# Altium project Ortho4Exent.PrjPcb
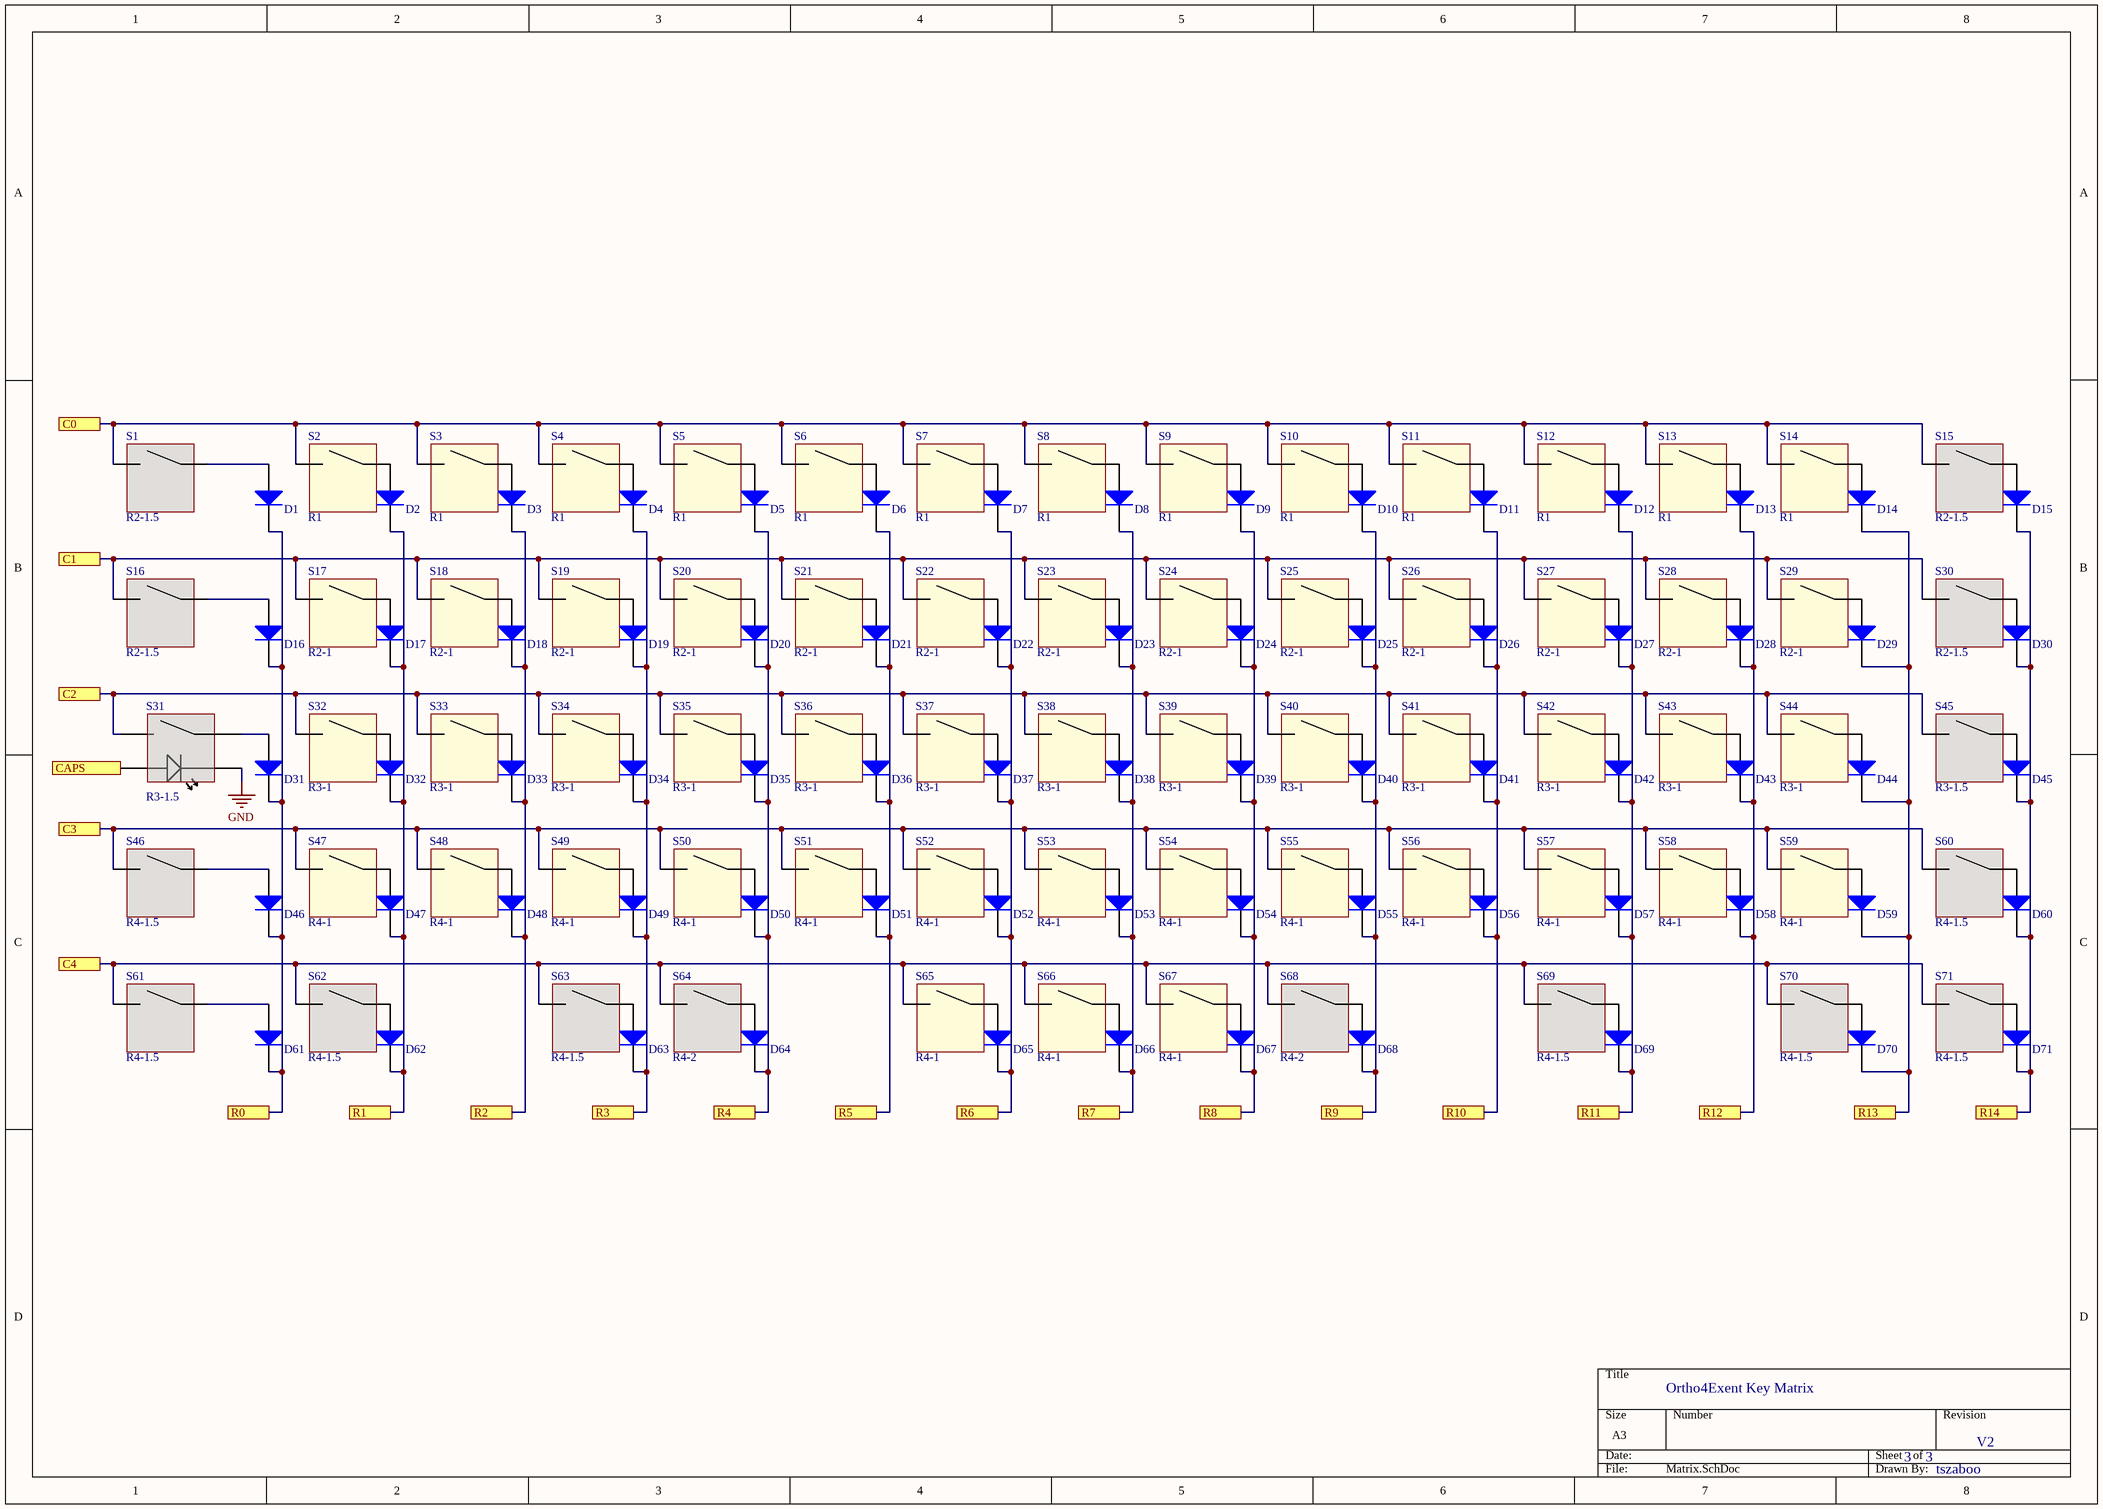
[diagram p0: Matrix.SchDoc]
3 sheets, 199 parts. Net scope: flat (ports and power ports of the same name join across sheets).
Board file: pcb.PcbDoc
Sheets:
  Matrix.SchDoc
  Underglow.SchDoc
  MCU.SchDoc

## Sheet Matrix.SchDoc
size A3; DocumentNumber: 3; SheetNumber: 3; SheetTotal: 3

### Parts
D1  1N4148WS  [SOD323FL]  (value not drawn)
D2  1N4148WS  [SOD323FL]  (value not drawn)
D3  1N4148WS  [SOD323FL]  (value not drawn)
D4  1N4148WS  [SOD323FL]  (value not drawn)
D5  1N4148WS  [SOD323FL]  (value not drawn)
D6  1N4148WS  [SOD323FL]  (value not drawn)
D7  1N4148WS  [SOD323FL]  (value not drawn)
D8  1N4148WS  [SOD323FL]  (value not drawn)
D9  1N4148WS  [SOD323FL]  (value not drawn)
D10  1N4148WS  [SOD323FL]  (value not drawn)
D11  1N4148WS  [SOD323FL]  (value not drawn)
D12  1N4148WS  [SOD323FL]  (value not drawn)
D13  1N4148WS  [SOD323FL]  (value not drawn)
D14  1N4148WS  [SOD323FL]  (value not drawn)
D15  1N4148WS  [SOD323FL]  (value not drawn)
D16  1N4148WS  [SOD323FL]  (value not drawn)
D17  1N4148WS  [SOD323FL]  (value not drawn)
D18  1N4148WS  [SOD323FL]  (value not drawn)
D19  1N4148WS  [SOD323FL]  (value not drawn)
D20  1N4148WS  [SOD323FL]  (value not drawn)
D21  1N4148WS  [SOD323FL]  (value not drawn)
D22  1N4148WS  [SOD323FL]  (value not drawn)
D23  1N4148WS  [SOD323FL]  (value not drawn)
D24  1N4148WS  [SOD323FL]  (value not drawn)
D25  1N4148WS  [SOD323FL]  (value not drawn)
D26  1N4148WS  [SOD323FL]  (value not drawn)
D27  1N4148WS  [SOD323FL]  (value not drawn)
D28  1N4148WS  [SOD323FL]  (value not drawn)
D29  1N4148WS  [SOD323FL]  (value not drawn)
D30  1N4148WS  [SOD323FL]  (value not drawn)
D31  1N4148WS  [SOD323FL]  (value not drawn)
D32  1N4148WS  [SOD323FL]  (value not drawn)
D33  1N4148WS  [SOD323FL]  (value not drawn)
D34  1N4148WS  [SOD323FL]  (value not drawn)
D35  1N4148WS  [SOD323FL]  (value not drawn)
D36  1N4148WS  [SOD323FL]  (value not drawn)
D37  1N4148WS  [SOD323FL]  (value not drawn)
D38  1N4148WS  [SOD323FL]  (value not drawn)
D39  1N4148WS  [SOD323FL]  (value not drawn)
D40  1N4148WS  [SOD323FL]  (value not drawn)
D41  1N4148WS  [SOD323FL]  (value not drawn)
D42  1N4148WS  [SOD323FL]  (value not drawn)
D43  1N4148WS  [SOD323FL]  (value not drawn)
D44  1N4148WS  [SOD323FL]  (value not drawn)
D45  1N4148WS  [SOD323FL]  (value not drawn)
D46  1N4148WS  [SOD323FL]  (value not drawn)
D47  1N4148WS  [SOD323FL]  (value not drawn)
D48  1N4148WS  [SOD323FL]  (value not drawn)
D49  1N4148WS  [SOD323FL]  (value not drawn)
D50  1N4148WS  [SOD323FL]  (value not drawn)
D51  1N4148WS  [SOD323FL]  (value not drawn)
D52  1N4148WS  [SOD323FL]  (value not drawn)
D53  1N4148WS  [SOD323FL]  (value not drawn)
D54  1N4148WS  [SOD323FL]  (value not drawn)
D55  1N4148WS  [SOD323FL]  (value not drawn)
D56  1N4148WS  [SOD323FL]  (value not drawn)
D57  1N4148WS  [SOD323FL]  (value not drawn)
D58  1N4148WS  [SOD323FL]  (value not drawn)
D59  1N4148WS  [SOD323FL]  (value not drawn)
D60  1N4148WS  [SOD323FL]  (value not drawn)
D61  1N4148WS  [SOD323FL]  (value not drawn)
D62  1N4148WS  [SOD323FL]  (value not drawn)
D63  1N4148WS  [SOD323FL]  (value not drawn)
D64  1N4148WS  [SOD323FL]  (value not drawn)
D65  1N4148WS  [SOD323FL]  (value not drawn)
D66  1N4148WS  [SOD323FL]  (value not drawn)
D67  1N4148WS  [SOD323FL]  (value not drawn)
D68  1N4148WS  [SOD323FL]  (value not drawn)
D69  1N4148WS  [SOD323FL]  (value not drawn)
D70  1N4148WS  [SOD323FL]  (value not drawn)
D71  1N4148WS  [SOD323FL]  (value not drawn)
S1  R2-1.5  [R2-1.5 NOLED]
S2  R1  [R1 NOLED]
S3  R1  [R1 NOLED]
S4  R1  [R1 NOLED]
S5  R1  [R1 NOLED]
S6  R1  [R1 NOLED]
S7  R1  [R1 NOLED]
S8  R1  [R1-1 NOLED 180]
S9  R1  [R1 NOLED]
S10  R1  [R1 NOLED]
S11  R1  [R1 NOLED]
S12  R1  [R1 NOLED]
S13  R1  [R1 NOLED]
S14  R1  [R1 NOLED]
S15  R2-1.5  [R2-1.5 NOLED]
S16  R2-1.5  [R2-1.5 NOLED]
S17  R2-1  [R2-1 NOLED]
S18  R2-1  [R2-1 NOLED]
S19  R2-1  [R2-1 NOLED]
S20  R2-1  [R2-1 NOLED]
S21  R2-1  [R2-1 NOLED]
S22  R2-1  [R2-1 NOLED]
S23  R2-1  [R2-1 NOLED]
S24  R2-1  [R2-1 NOLED]
S25  R2-1  [R2-1 NOLED]
S26  R2-1  [R2-1 NOLED]
S27  R2-1  [R2-1 NOLED]
S28  R2-1  [R2-1 NOLED]
S29  R2-1  [R2-1 NOLED]
S30  R2-1.5  [R2-1.5 NOLED]
S31  R3-1.5  [R3-1.5]
S32  R3-1  [R3-1 NOLED]
S33  R3-1  [R3-1 NOLED]
S34  R3-1  [R3-1 NOLED]
S35  R3-1  [R3-1 NOLED]
S36  R3-1  [R3-1 NOLED]
S37  R3-1  [R3-1 NOLED]
S38  R3-1  [R3-1 NOLED]
S39  R3-1  [R3-1 NOLED]
S40  R3-1  [R3-1 NOLED]
S41  R3-1  [R3-1 NOLED]
S42  R3-1  [R3-1 NOLED]
S43  R3-1  [R3-1 NOLED]
S44  R3-1  [R3-1 NOLED]
S45  R3-1.5  [R3-1.5 NOLED]
S46  R4-1.5  [R4-1.5 NOLED]
S47  R4-1  [R4-1 NOLED]
S48  R4-1  [R4-1 NOLED]
S49  R4-1  [R4-1 NOLED]
S50  R4-1  [R4-1 NOLED]
S51  R4-1  [R4-1 NOLED]
S52  R4-1  [R4-1 NOLED]
S53  R4-1  [R4-1 NOLED]
S54  R4-1  [R4-1 NOLED]
S55  R4-1  [R4-1 NOLED]
S56  R4-1  [R4-1 NOLED]
S57  R4-1  [R4-1 NOLED]
S58  R4-1  [R4-1 NOLED]
S59  R4-1  [R4-1 NOLED]
S60  R4-1.5  [R4-1.5 NOLED]
S61  R4-1.5  [R4-1.5 NOLED]  (no BOM)
S62  R4-1.5  [R4-1.5 NOLED]
S63  R4-1.5  [R4-1.5 NOLED]
S64  R4-2  [R4-2 NOLED 180]
S65  R4-1  [R4-1 NOLED]
S66  R4-1  [R4-1 NOLED]
S67  R4-1  [R4-1 NOLED]
S68  R4-2  [R4-2 NOLED 180]
S69  R4-1.5  [R4-1.5 NOLED]
S70  R4-1.5  [R4-1.5 NOLED]
S71  R4-1.5  [R4-1.5 NOLED]

### Ports
C0, C1, C2, C3, C4, CAPS, R0, R1, R2, R3, R4, R5, R6, R7, R8, R9, R10, R11, R12, R13, R14

### Nets
GND: S31.3
C0: S1.1 S2.1 S3.1 S4.1 S5.1 S6.1 S7.1 S8.1 S9.1 S10.1 S11.1 S12.1 S13.1 S14.1 S15.1 ; port C0
C1: S16.1 S17.1 S18.1 S19.1 S20.1 S21.1 S22.1 S23.1 S24.1 S25.1 S26.1 S27.1 S28.1 S29.1 S30.1 ; port C1
C2: S31.1 S32.1 S33.1 S34.1 S35.1 S36.1 S37.1 S38.1 S39.1 S40.1 S41.1 S42.1 S43.1 S44.1 S45.1 ; port C2
C3: S46.1 S47.1 S48.1 S49.1 S50.1 S51.1 S52.1 S53.1 S54.1 S55.1 S56.1 S57.1 S58.1 S59.1 S60.1 ; port C3
C4: S61.1 S62.1 S63.1 S64.1 S65.1 S66.1 S67.1 S68.1 S69.1 S70.1 S71.1 ; port C4
CAPS: S31.4 ; port CAPS
R0: D1.2(K) D16.2(K) D31.2(K) D46.2(K) D61.2(K) ; port R0
R1: D2.2(K) D17.2(K) D32.2(K) D47.2(K) D62.2(K) ; port R1
R2: D3.2(K) D18.2(K) D33.2(K) D48.2(K) ; port R2
R3: D4.2(K) D19.2(K) D34.2(K) D49.2(K) D63.2(K) ; port R3
R4: D5.2(K) D20.2(K) D35.2(K) D50.2(K) D64.2(K) ; port R4
R5: D6.2(K) D21.2(K) D36.2(K) D51.2(K) ; port R5
R6: D7.2(K) D22.2(K) D37.2(K) D52.2(K) D65.2(K) ; port R6
R7: D8.2(K) D23.2(K) D38.2(K) D53.2(K) D66.2(K) ; port R7
R8: D9.2(K) D24.2(K) D39.2(K) D54.2(K) D67.2(K) ; port R8
R9: D10.2(K) D25.2(K) D40.2(K) D55.2(K) D68.2(K) ; port R9
R10: D11.2(K) D26.2(K) D41.2(K) D56.2(K) ; port R10
R11: D12.2(K) D27.2(K) D42.2(K) D57.2(K) D69.2(K) ; port R11
R12: D13.2(K) D28.2(K) D43.2(K) D58.2(K) ; port R12
R13: D14.2(K) D29.2(K) D44.2(K) D59.2(K) D70.2(K) ; port R13
R14: D15.2(K) D30.2(K) D45.2(K) D60.2(K) D71.2(K) ; port R14
NetD1_1: D1.1(A) S1.2
NetD2_1: D2.1(A) S2.2
NetD3_1: D3.1(A) S3.2
NetD4_1: D4.1(A) S4.2
NetD5_1: D5.1(A) S5.2
NetD6_1: D6.1(A) S6.2
NetD7_1: D7.1(A) S7.2
NetD8_1: D8.1(A) S8.2
NetD9_1: D9.1(A) S9.2
NetD10_1: D10.1(A) S10.2
NetD11_1: D11.1(A) S11.2
NetD12_1: D12.1(A) S12.2
NetD13_1: D13.1(A) S13.2
NetD14_1: D14.1(A) S14.2
NetD15_1: D15.1(A) S15.2
NetD16_1: D16.1(A) S16.2
NetD17_1: D17.1(A) S17.2
NetD18_1: D18.1(A) S18.2
NetD19_1: D19.1(A) S19.2
NetD20_1: D20.1(A) S20.2
NetD21_1: D21.1(A) S21.2
NetD22_1: D22.1(A) S22.2
NetD23_1: D23.1(A) S23.2
NetD24_1: D24.1(A) S24.2
NetD25_1: D25.1(A) S25.2
NetD26_1: D26.1(A) S26.2
NetD27_1: D27.1(A) S27.2
NetD28_1: D28.1(A) S28.2
NetD29_1: D29.1(A) S29.2
NetD30_1: D30.1(A) S30.2
NetD31_1: D31.1(A) S31.2
NetD32_1: D32.1(A) S32.2
NetD33_1: D33.1(A) S33.2
NetD34_1: D34.1(A) S34.2
NetD35_1: D35.1(A) S35.2
NetD36_1: D36.1(A) S36.2
NetD37_1: D37.1(A) S37.2
NetD38_1: D38.1(A) S38.2
NetD39_1: D39.1(A) S39.2
NetD40_1: D40.1(A) S40.2
NetD41_1: D41.1(A) S41.2
NetD42_1: D42.1(A) S42.2
NetD43_1: D43.1(A) S43.2
NetD44_1: D44.1(A) S44.2
NetD45_1: D45.1(A) S45.2
NetD46_1: D46.1(A) S46.2
NetD47_1: D47.1(A) S47.2
NetD48_1: D48.1(A) S48.2
NetD49_1: D49.1(A) S49.2
NetD50_1: D50.1(A) S50.2
NetD51_1: D51.1(A) S51.2
NetD52_1: D52.1(A) S52.2
NetD53_1: D53.1(A) S53.2
NetD54_1: D54.1(A) S54.2
NetD55_1: D55.1(A) S55.2
NetD56_1: D56.1(A) S56.2
NetD57_1: D57.1(A) S57.2
NetD58_1: D58.1(A) S58.2
NetD59_1: D59.1(A) S59.2
NetD60_1: D60.1(A) S60.2
NetD61_1: D61.1(A) S61.2
NetD62_1: D62.1(A) S62.2
NetD63_1: D63.1(A) S63.2
NetD64_1: D64.1(A) S64.2
NetD65_1: D65.1(A) S65.2
NetD66_1: D66.1(A) S66.2
NetD67_1: D67.1(A) S67.2
NetD68_1: D68.1(A) S68.2
NetD69_1: D69.1(A) S69.2
NetD70_1: D70.1(A) S70.2
NetD71_1: D71.1(A) S71.2

### Notes on the sheet
- Ortho4Exent Key Matrix
- 3
- V2
- tszaboo

### Library data of the parts
D1-D71 = 1N4148WS: Default Diode; MANUF: ON Semi; DESCIPTION: DIODE GEN PURP 80V 125MA SOD323; COMPATIBLES: True; NoPins: 2; GENERIC: 1N4148; MANUFCODE: 1N4148WS; DIGIKEY: 1N4148WSFSTR-ND; FARNELL: 2453270; SMD: True; PACKAGE: SOD323-FL

## Sheet Underglow.SchDoc
size A4; DocumentNumber: 2; SheetNumber: 2; SheetTotal: 3
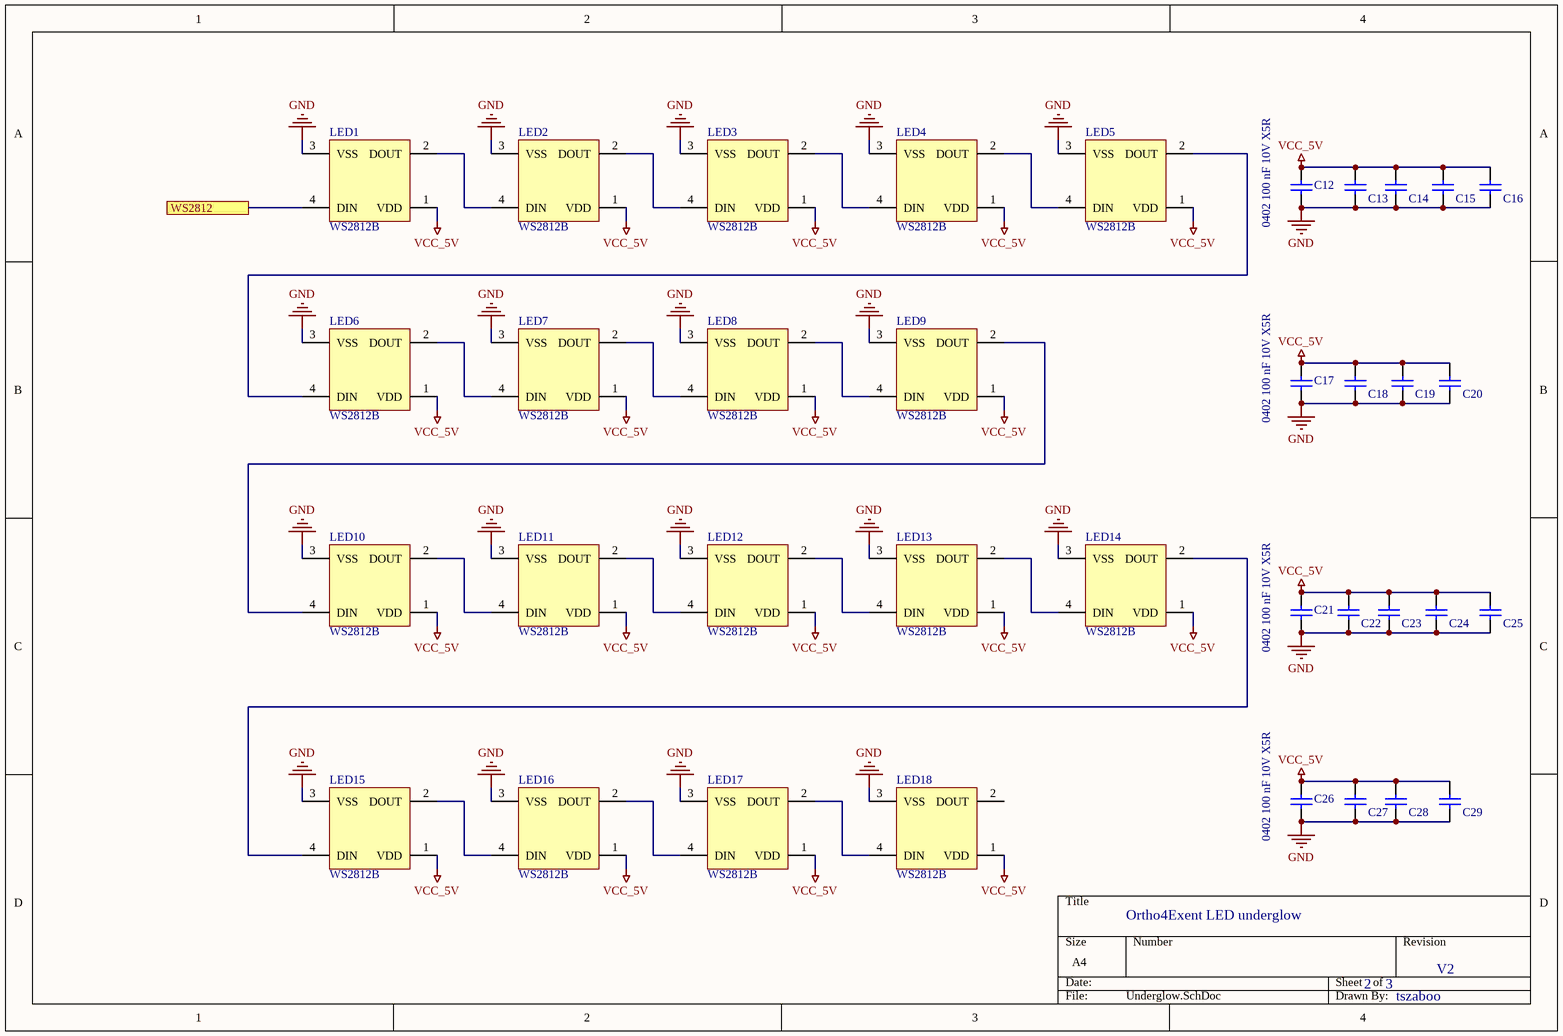
[diagram p1: Underglow.SchDoc]

### Parts
C12  SCH: 0402 100 nF 10V X5R  [CAPC0402N]  (hidden comment: 0402 100nF)
C13  0402 100nF  [CAPC0402N]  (value not drawn)
C14  0402 100nF  [CAPC0402N]  (value not drawn)
C15  0402 100nF  [CAPC0402N]  (value not drawn)
C16  0402 100nF  [CAPC0402N]  (value not drawn)
C17  SCH: 0402 100 nF 10V X5R  [CAPC0402N]  (hidden comment: 0402 100nF)
C18  0402 100nF  [CAPC0402N]  (value not drawn)
C19  0402 100nF  [CAPC0402N]  (value not drawn)
C20  0402 100nF  [CAPC0402N]  (value not drawn)
C21  SCH: 0402 100 nF 10V X5R  [CAPC0402N]  (hidden comment: 0402 100nF)
C22  0402 100nF  [CAPC0402N]  (value not drawn)
C23  0402 100nF  [CAPC0402N]  (value not drawn)
C24  0402 100nF  [CAPC0402N]  (value not drawn)
C25  0402 100nF  [CAPC0402N]  (value not drawn)
C26  SCH: 0402 100 nF 10V X5R  [CAPC0402N]  (hidden comment: 0402 100nF)
C27  0402 100nF  [CAPC0402N]  (value not drawn)
C28  0402 100nF  [CAPC0402N]  (value not drawn)
C29  0402 100nF  [CAPC0402N]  (value not drawn)
LED1  WS2812B  [WS2812]
LED2  WS2812B  [WS2812]
LED3  WS2812B  [WS2812]
LED4  WS2812B  [WS2812]
LED5  WS2812B  [WS2812]
LED6  WS2812B  [WS2812]
LED7  WS2812B  [WS2812]
LED8  WS2812B  [WS2812]
LED9  WS2812B  [WS2812]
LED10  WS2812B  [WS2812]
LED11  WS2812B  [WS2812]
LED12  WS2812B  [WS2812]
LED13  WS2812B  [WS2812]
LED14  WS2812B  [WS2812]
LED15  WS2812B  [WS2812]
LED16  WS2812B  [WS2812]
LED17  WS2812B  [WS2812]
LED18  WS2812B  [WS2812]

### Ports
WS2812

### Nets
GND: C12.1 C13.1 C14.1 C15.1 C16.1 C17.1 C18.1 C19.1 C20.1 C21.1 C22.1 C23.1 C24.1 C25.1 C26.1 C27.1 C28.1 C29.1 LED1.3(VSS) LED2.3(VSS) LED3.3(VSS) LED4.3(VSS) LED5.3(VSS) LED6.3(VSS) LED7.3(VSS) LED8.3(VSS) LED9.3(VSS) LED10.3(VSS) LED11.3(VSS) LED12.3(VSS) LED13.3(VSS) LED14.3(VSS) LED15.3(VSS) LED16.3(VSS) LED17.3(VSS) LED18.3(VSS)
VCC_5V: C12.2 C13.2 C14.2 C15.2 C16.2 C17.2 C18.2 C19.2 C20.2 C21.2 C22.2 C23.2 C24.2 C25.2 C26.2 C27.2 C28.2 C29.2 LED1.1(VDD) LED2.1(VDD) LED3.1(VDD) LED4.1(VDD) LED5.1(VDD) LED6.1(VDD) LED7.1(VDD) LED8.1(VDD) LED9.1(VDD) LED10.1(VDD) LED11.1(VDD) LED12.1(VDD) LED13.1(VDD) LED14.1(VDD) LED15.1(VDD) LED16.1(VDD) LED17.1(VDD) LED18.1(VDD)
WS2812: LED1.4(DIN) ; port WS2812
NetLED1_2: LED1.2(DOUT) LED2.4(DIN)
NetLED2_2: LED2.2(DOUT) LED3.4(DIN)
NetLED3_2: LED3.2(DOUT) LED4.4(DIN)
NetLED4_2: LED4.2(DOUT) LED5.4(DIN)
NetLED5_2: LED5.2(DOUT) LED6.4(DIN)
NetLED6_2: LED6.2(DOUT) LED7.4(DIN)
NetLED7_2: LED7.2(DOUT) LED8.4(DIN)
NetLED8_2: LED8.2(DOUT) LED9.4(DIN)
NetLED9_2: LED9.2(DOUT) LED10.4(DIN)
NetLED10_2: LED10.2(DOUT) LED11.4(DIN)
NetLED11_2: LED11.2(DOUT) LED12.4(DIN)
NetLED12_2: LED12.2(DOUT) LED13.4(DIN)
NetLED13_2: LED13.2(DOUT) LED14.4(DIN)
NetLED14_2: LED14.2(DOUT) LED15.4(DIN)
NetLED15_2: LED15.2(DOUT) LED16.4(DIN)
NetLED16_2: LED16.2(DOUT) LED17.4(DIN)
NetLED17_2: LED17.2(DOUT) LED18.4(DIN)

Not connected (* = marked no-connect by the designer): LED18 2(DOUT)

### Notes on the sheet
- Ortho4Exent LED underglow
- 2
- 3
- V2
- tszaboo

### Library data of the parts
C12 C17 C21 C26 = 885012105010: MANUF: WE; DESCIPTION: CAP SMD 0402 100 nF 10V X5R; NoPins: 2; SUPPLY: SUB; VOLTAGE: 10; TECH: X5R; COMPATIBLES: True; MANUFCODE: 885012105010; DIGIKEY: 732-7487-2-ND; SMD: YES; VALUE: 100 nF
C13-C16 C18-C20 C22-C25 C27-C29 = 885012105010: MANUF: WE; SCH: 0402 100 nF 10V X5R; DESCIPTION: CAP SMD 0402 100 nF 10V X5R; NoPins: 2; SUPPLY: SUB; VOLTAGE: 10; TECH: X5R; COMPATIBLES: True; MANUFCODE: 885012105010; DIGIKEY: 732-7487-2-ND; SMD: YES; VALUE: 100 nF
LED1-LED18 = WS2812: MANUF: Worldsemi; DESCIPTION: ADDRESS LED RED/GRN/BLUE; NoPins: 4; COMPATIBLES: False; DIGIKEY: COM-16347; MANUFCODE: WS2812B

## Sheet MCU.SchDoc
size A4; DocumentNumber: 1; SheetNumber: 1; SheetTotal: 3
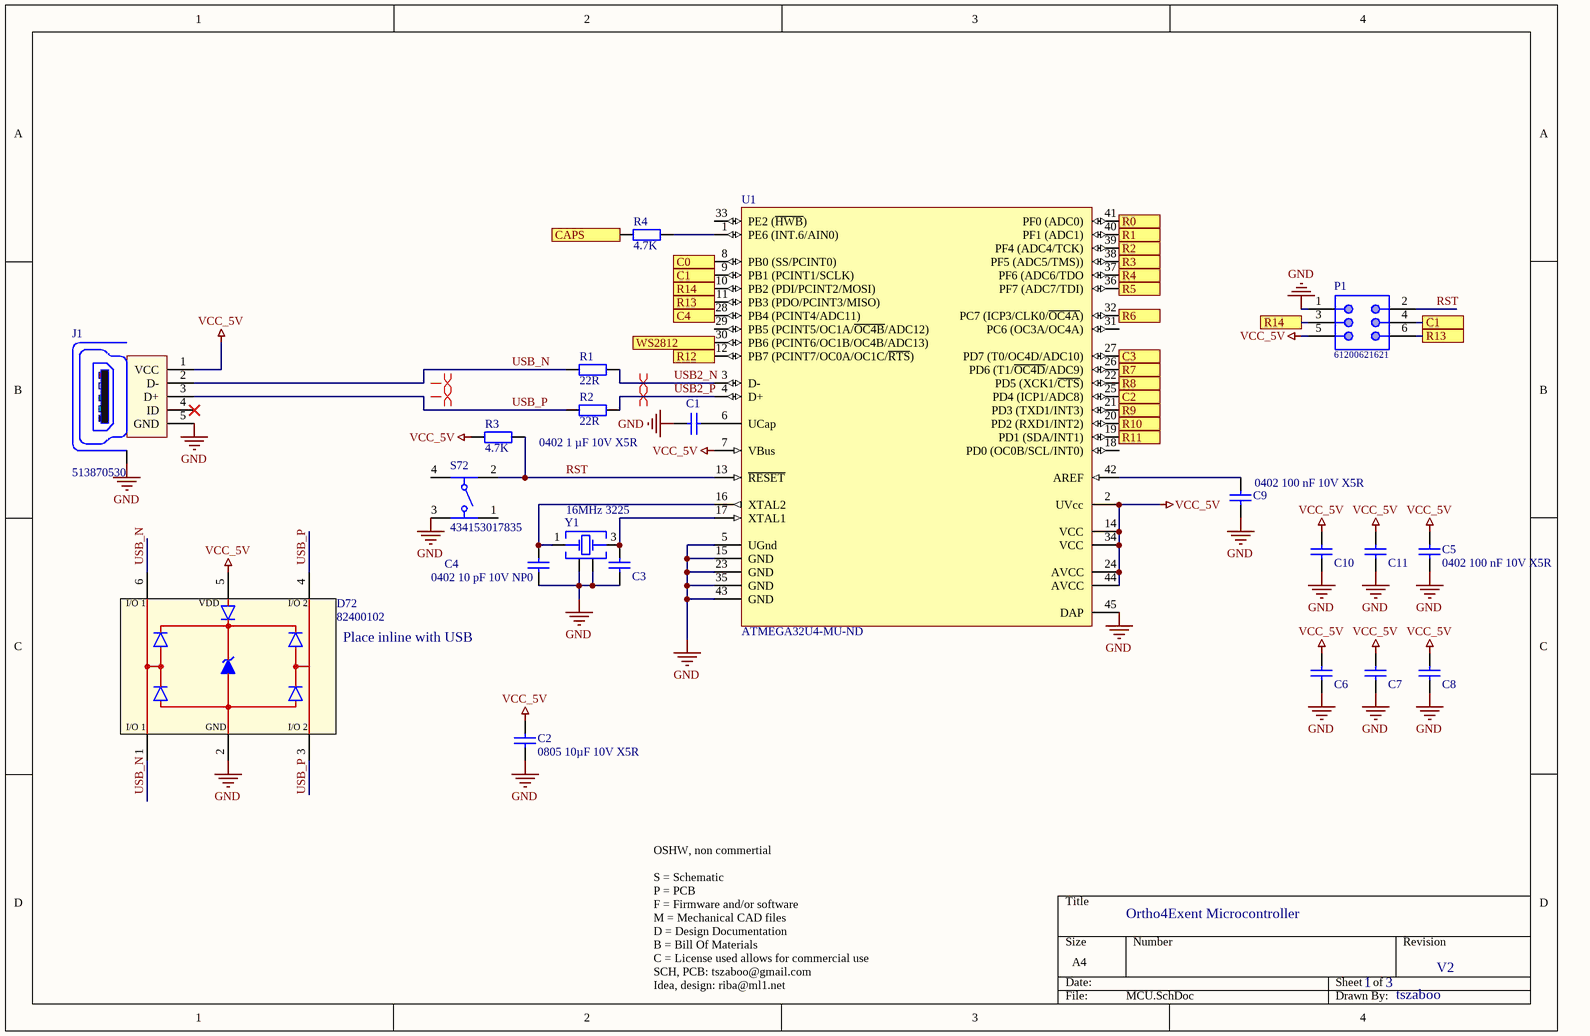
[diagram p2: MCU.SchDoc]

### Parts
C1  SCH: 0402 1 µF 10V X5R  [CAPC0402N]  (hidden comment: 0402 1µF)
C2  SCH: 0805 10µF 10V X5R  [CAPC0805N]  (hidden comment: 0805 10µF)
C3  0402 10pF  [CAPC0402N]  (value not drawn)
C4  SCH: 0402 10 pF 10V NP0  [CAPC0402N]  (hidden comment: 0402 10pF)
C5  SCH: 0402 100 nF 10V X5R  [CAPC0402N]  (hidden comment: 0402 100nF)
C6  0402 100nF  [CAPC0402N]  (value not drawn)
C7  0402 100nF  [CAPC0402N]  (value not drawn)
C8  0402 100nF  [CAPC0402N]  (value not drawn)
C9  SCH: 0402 100 nF 10V X5R  [CAPC0402N]  (hidden comment: 0402 100nF)
C10  0402 100nF  [CAPC0402N]  (value not drawn)
C11  0402 100nF  [CAPC0402N]  (value not drawn)
D72  82400102  [SOT23-6L]
J1  513870530  [513870530]
P1  61200621621  [61200621621]
R1  value 22R  [RESC0603N]  (hidden comment: RES 22R 0603)
R2  value 22R  [RESC0603N]  (hidden comment: RES 22R 0603)
R3  value 4.7K  [RESC0402N]  (hidden comment: RES 4.7K 0402)
R4  value 4.7K  [RESC0402N]  (hidden comment: RES 4.7K 0402)
S72  434153017835  [434153017835]
U1  ATMEGA32U4-MU-ND  [44PW_M]
Y1  16MHz 3225  [WE-XTAL_CFPX-180]

### Ports
C0, C1, C2, C3, C4, CAPS, R0, R1, R2, R3, R4, R5, R6, R7, R8, R9, R10, R11, R12, R13, R14, WS2812

### Nets
GND: C1.1 C2.1 C3.1 C4.1 C5.1 C6.1 C7.1 C8.1 C9.1 C10.1 C11.1 D72.2(GND) J1.5(GND) J1.TAB P1.1 S72.3 U1.5(UGnd) U1.15(GND) U1.23(GND) U1.35(GND) U1.43(GND) U1.45(DAP) Y1.2(GND) Y1.4(GND)
VCC_5V: C2.2 C5.2 C6.2 C7.2 C8.2 C10.2 C11.2 D72.5(VDD) J1.1(VCC) P1.5 R3.2 U1.2(UVcc) U1.7(VBus) U1.14(VCC) U1.24(AVCC) U1.34(VCC) U1.44(AVCC)
C0: U1.8(PB0_(SS/PCINT0)) ; port C0
C1: P1.4 U1.9(PB1_(PCINT1/SCLK)) ; port C1
C2: U1.25(PD4_(ICP1/ADC8)) ; port C2
C3: U1.27(PD7_(T0/OC4D/ADC10)) ; port C3
C4: U1.28(PB4_(PCINT4/ADC11)) ; port C4
CAPS: R4.2 ; port CAPS
R0: U1.41(PF0_(ADC0)) ; port R0
R1: U1.40(PF1_(ADC1)) ; port R1
R2: U1.39(PF4_(ADC4/TCK)) ; port R2
R3: U1.38(PF5_(ADC5/TMS))) ; port R3
R4: U1.37(PF6_(ADC6/TDO) ; port R4
R5: U1.36(PF7_(ADC7/TDI)) ; port R5
R6: U1.32(PC7_(ICP3/CLK0/~{OC4A})) ; port R6
R7: U1.26(PD6_(T1/~{OC4D}/ADC9)) ; port R7
R8: U1.22(PD5_(XCK1/~{CTS})) ; port R8
R9: U1.21(PD3_(TXD1/INT3)) ; port R9
R10: U1.20(PD2_(RXD1/INT2)) ; port R10
R11: U1.19(PD1_(SDA/INT1)) ; port R11
R12: U1.12(PB7_(PCINT7/OC0A/OC1C/~{RTS})) ; port R12
R13: P1.6 U1.11(PB3_(PDO/PCINT3/MISO)) ; port R13
R14: P1.3 U1.10(PB2_(PDI/PCINT2/MOSI)) ; port R14
RST: P1.2 R3.1 S72.2 U1.13(~{RESET})
USB2_N: R1.2 U1.3(D-)
USB2_P: R2.2 U1.4(D+)
USB_N: D72.1(I/O_1) D72.6(I/O_1) J1.2(D-) R1.1
USB_P: D72.3(I/O_2) D72.4(I/O_2) J1.3(D+) R2.1
WS2812: U1.30(PB6_(PCINT6/OC1B/OC4B/ADC13)) ; port WS2812
NetC1_2: C1.2 U1.6(UCap)
NetC3_2: C3.2 U1.17(XTAL1) Y1.3(Crystal)
NetC4_2: C4.2 U1.16(XTAL2) Y1.1(Crystal)
NetC9_2: C9.2 U1.42(AREF)
NetR4_1: R4.1 U1.1(PE6_(INT.6/AIN0))

Not connected (* = marked no-connect by the designer): J1 4(ID)*; S72 1 4; U1 18(PD0_(OC0B/SCL/INT0)) 29(PB5_(PCINT5/OC1A/~{OC4B}/ADC12)) 31(PC6_(OC3A/OC4A)) 33(PE2_(~{HWB}))

### Layout directives
differential pair: (no net found under the mark), USB2_N, USB2_P

### Notes on the sheet
- (near D72) Place inline with USB
- Ortho4Exent Microcontroller
- OSHW, non commertial
  S = Schematic
  P = PCB
  F = Firmware and/or software
  M = Mechanical CAD files
  D = Design Documentation
  B = Bill Of Materials
  C = License used allows for commercial use
  SCH, PCB: tszaboo@gmail.com
  Idea, design: riba@ml1.net
- 1
- 3
- V2
- tszaboo

### Library data of the parts
C1 = 885012105012: MANUF: WE; DESCIPTION: CAP SMD 0402 1 µF 10V X5R; NoPins: 2; SUPPLY: SUB; VOLTAGE: 10; TECH: X5R; COMPATIBLES: True; MANUFCODE: 885012105012; DIGIKEY: 732-7489-2-ND; SMD: YES; VALUE: 1 µF
C2 = 885012107010: MANUF: WE; DESCIPTION: CAP SMD 0805 10 µF 10 V X5R; NoPins: 2; SUPPLY: SUB; VOLTAGE: 10; TECH: X5R; COMPATIBLES: True; MANUFCODE: 885012107010; DIGIKEY: 732-7620-2-ND; SMD: YES; VALUE: 10 µF
C3 = 885012005007: MANUF: WE; SCH: 0402 10 pF 10V NP0; DESCIPTION: CAP SMD 0402 10 pF 10V NP0; NoPins: 2; SUPPLY: SUB; VOLTAGE: 10; TECH: NP0; COMPATIBLES: True; MANUFCODE: 885012005007; DIGIKEY: 732-7425-2-ND; SMD: YES; VALUE: 10 pF
C4 = 885012005007: MANUF: WE; DESCIPTION: CAP SMD 0402 10 pF 10V NP0; NoPins: 2; SUPPLY: SUB; VOLTAGE: 10; TECH: NP0; COMPATIBLES: True; MANUFCODE: 885012005007; DIGIKEY: 732-7425-2-ND; SMD: YES; VALUE: 10 pF
C5 C9 = 885012105010: as C12 on sheet Underglow; MANUFCODE: 885012105010; DIGIKEY: 732-7487-2-ND; SMD: YES; VALUE: 100 nF
C6-C8 C10 C11 = 885012105010: as C13 on sheet Underglow; MANUFCODE: 885012105010; DIGIKEY: 732-7487-2-ND; SMD: YES; VALUE: 100 nF
D72 = WE-TVS, SOT23-6L, 82400102: WE-TVS TVS Diode, High Speed Series, SOT23-6L, VDC = 5V; MANUF: WE; COMPATIBLES: False; DESCIPTION: WE-TVS TVS Diode, High Speed Series, SOT23-6L, VDC = 5V; DIGIKEY: 732-4473-1-ND; MANUFCODE: 82400102
J1 = 513870530: Mini USB, B-Receptacle, Right-Angle, Short Body, Surface Mount Solder Tails and Through Hole Shell Tabs, with Cover Tape, Reflow DIP Type, Lead-Free; MANUF: MOLEX; DESCIPTION: USB - mini B USB 2.0 OTG Receptacle Connector 5 Position Surface Mount; COMPATIBLES: False; MANUFCODE: 513870530; DIGIKEY: WM3756TR-ND
P1 = 61200621621: Male Box Header WR-BHD, THT, Vertical, pitch 2.54 mm, 6 pins; COMPATIBLES: True
R1 R2 = CRCW060322R0FKEA: Resistor; MANUF: VISHAY; COMPATIBLES: True; NoPins: 2; SUPPLY: SUB; DESCIPTION: RES SMD 22 OHM 1% 1/10W 100PPM 0603; MANUFCODE: CRCW060322R0FKEA; DIGIKEY: 541-22.0HCT-ND; FARNELL: #N/A; SMD: YES; SCH: RES 22R 0603
R3 R4 = CRCW04024K70FKED: Resistor; MANUF: VISHAY; COMPATIBLES: True; NoPins: 2; SUPPLY: SUB; DESCIPTION: RES SMD 4.7K OHM 1% 1/16W 100PPM 0402; MANUFCODE: CRCW04024K70FKED; DIGIKEY: 541-4.70KLCT-ND; FARNELL: TBD; SMD: YES; SCH: RES 4.7K 0402
S72 = 434153017835: WS-TASV J-Bend SMT Tact Switch, 3.5x2.9x1.7mm, 350gf; MANUF: WE; DESCIPTION: SWITCH TACTILE SPST-NO 0.05A 12V; COMPATIBLES: True; MANUFCODE: 434153017835; DIGIKEY: 732-10143-1-ND
U1 = CMP-0095-00166-2: 8-bit AVR Microcontroller, 2.7-5.5V, 16MHz, 32KB Flash, 1KB EEPROM, 2.5KB SRAM, USB Controller, 44-pin QFN, Industrial Grade (-40°C to 85°C), Ext Osc; MANUF: Microchip; NoPins: 44; DESCIPTION: IC MCU 8BIT 32KB FLASH 44VQFN; COMPATIBLES: False; MANUFCODE: ATMEGA32U4-MU-ND; DIGIKEY: ATMEGA32U4-MU-ND
Y1 = 830055951: WE-XTAL Quartz Crystal, SMT, CFPX-180, 16MHz, +/-20ppm; MANUF: WE/IQD; DESCIPTION: CRYSTAL 16.0000MHZ 18PF SMD; COMPATIBLES: True; MANUFCODE: 830055951; DIGIKEY: 1923-1308-1-ND

## Nets that join several sheets
GND: Matrix (S31.3), Underglow (36 pins), MCU (24 pins)
VCC_5V: Underglow (36 pins), MCU (17 pins)
C0: Matrix (15 pins), MCU (U1.8)
C1: Matrix (15 pins), MCU (P1.4 U1.9)
C2: Matrix (15 pins), MCU (U1.25)
C3: Matrix (15 pins), MCU (U1.27)
C4: Matrix (11 pins), MCU (U1.28)
CAPS: Matrix (S31.4), MCU (R4.2)
R0: Matrix (5 pins), MCU (U1.41)
R1: Matrix (5 pins), MCU (U1.40)
R2: Matrix (D3.2 D18.2 D33.2 D48.2), MCU (U1.39)
R3: Matrix (5 pins), MCU (U1.38)
R4: Matrix (5 pins), MCU (U1.37)
R5: Matrix (D6.2 D21.2 D36.2 D51.2), MCU (U1.36)
R6: Matrix (5 pins), MCU (U1.32)
R7: Matrix (5 pins), MCU (U1.26)
R8: Matrix (5 pins), MCU (U1.22)
R9: Matrix (5 pins), MCU (U1.21)
R10: Matrix (D11.2 D26.2 D41.2 D56.2), MCU (U1.20)
R11: Matrix (5 pins), MCU (U1.19)
R12: Matrix (D13.2 D28.2 D43.2 D58.2), MCU (U1.12)
R13: Matrix (5 pins), MCU (P1.6 U1.11)
R14: Matrix (5 pins), MCU (P1.3 U1.10)
WS2812: Underglow (LED1.4), MCU (U1.30)

## Assembly variants
PRODUCTION: not fitted P1 S1 S2 S3 S4 S5 S6 S7 S8 S9 S10 S11 S12 S13 S14 S15 S16 S17 S18 S19 S20 S21 S22 S23 S24 S25 S26 S27 S28 S29 S30 S31 S32 S33 S34 S35 S36 S37 S38 S39 S40 S41 S42 S43 S44 S45 S46 S47 S48 S49 S50 S51 S52 S53 S54 S55 S56 S57 S58 S59 S60 S61 S62 S63 S64 S65 S66 S67 S68 S69 S70 S71